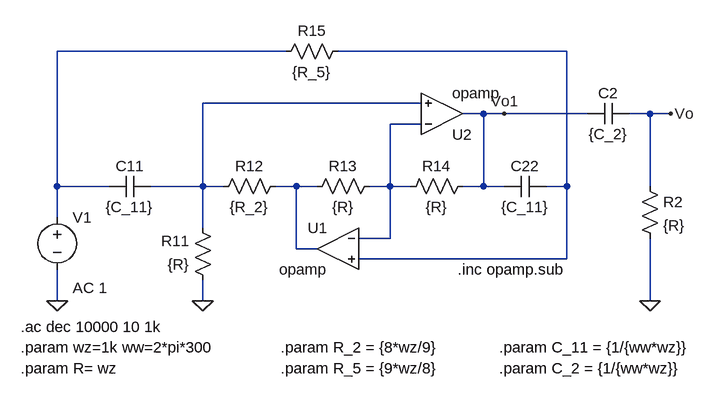
[diagram p0: schematic Circuito_param.asc]
Circuito_param.asc, the LTspice schematic file:
Version 4
SHEET 1 1584 1240
WIRE 240 -96 -112 -96
WIRE 672 -96 320 -96
WIRE 448 -16 112 -16
WIRE 544 0 512 0
WIRE 576 0 544 0
WIRE 704 0 576 0
WIRE 800 0 768 0
WIRE 832 0 800 0
WIRE 448 16 400 16
WIRE -112 112 -112 -96
WIRE -32 112 -112 112
WIRE 112 112 112 -16
WIRE 112 112 32 112
WIRE 144 112 112 112
WIRE 256 112 224 112
WIRE 288 112 256 112
WIRE 400 112 400 16
WIRE 400 112 368 112
WIRE 432 112 400 112
WIRE 544 112 544 0
WIRE 544 112 512 112
WIRE 576 112 544 112
WIRE 672 112 672 -96
WIRE 672 112 640 112
WIRE 800 112 800 0
WIRE -112 160 -112 112
WIRE 112 176 112 112
WIRE 400 192 400 112
WIRE 400 192 352 192
WIRE 256 208 256 112
WIRE 288 208 256 208
WIRE 672 224 672 112
WIRE 672 224 352 224
WIRE -112 288 -112 240
WIRE 112 288 112 256
WIRE 800 288 800 192
FLAG 112 288 0
FLAG 576 0 Vo1
FLAG -112 288 0
FLAG 800 288 0
FLAG 832 0 Vo
SYMBOL cap 32 96 R90
WINDOW 0 0 32 VBottom 2
WINDOW 3 32 32 VTop 2
SYMATTR InstName C11
SYMATTR Value {C_11}
SYMBOL res 240 96 R90
WINDOW 0 0 56 VBottom 2
WINDOW 3 32 56 VTop 2
SYMATTR InstName R12
SYMATTR Value {R_2}
SYMBOL OpAmps\\opamp 320 144 M0
SYMATTR InstName U1
SYMBOL cap 640 96 R90
WINDOW 0 0 32 VBottom 2
WINDOW 3 32 32 VTop 2
SYMATTR InstName C22
SYMATTR Value {C_11}
SYMBOL res 384 96 R90
WINDOW 0 0 56 VBottom 2
WINDOW 3 32 56 VTop 2
SYMATTR InstName R13
SYMATTR Value {R}
SYMBOL res 528 96 R90
WINDOW 0 0 56 VBottom 2
WINDOW 3 32 56 VTop 2
SYMATTR InstName R14
SYMATTR Value {R}
SYMBOL res 336 -112 R90
WINDOW 0 0 56 VBottom 2
WINDOW 3 32 56 VTop 2
SYMATTR InstName R15
SYMATTR Value {R_5}
SYMBOL OpAmps\\opamp 480 64 M180
SYMATTR InstName U2
SYMBOL voltage -112 144 R0
WINDOW 123 24 124 Left 2
WINDOW 39 0 0 Left 0
SYMATTR Value2 AC 1
SYMATTR InstName V1
SYMATTR Value ""
SYMBOL res 128 272 R180
WINDOW 0 36 76 Left 2
WINDOW 3 36 40 Left 2
SYMATTR InstName R11
SYMATTR Value {R}
SYMBOL cap 768 -16 R90
WINDOW 0 0 32 VBottom 2
WINDOW 3 32 32 VTop 2
SYMATTR InstName C2
SYMATTR Value {C_2}
SYMBOL res 784 96 R0
SYMATTR InstName R2
SYMATTR Value {R}
TEXT -168 392 Left 2 !.param R= wz
TEXT 568 360 Left 2 !.param C_11 = {1/{ww*wz}}
TEXT 568 392 Left 2 !.param C_2 = {1/{ww*wz}}
TEXT 232 392 Left 2 !.param R_5 = {9*wz/8}
TEXT 504 240 Left 2 !.inc opamp.sub
TEXT -168 328 Left 2 !.ac dec 10000 10 1k
TEXT -168 360 Left 2 !.param wz=1k ww=2*pi*300
TEXT 232 360 Left 2 !.param R_2 = {8*wz/9}

The netlist it stands for:
* Circuito_param.asc
C11 N003 N001 {C_11}
R12 N005 N003 {R_2}
XU1 N004 N002 N005 opamp Aol=100K GBW=10Meg  ; pins invin noninvin out
C22 N002 Vo1 {C_11}
R13 N004 N005 {R}
R14 Vo1 N004 {R}
R15 N002 N001 {R_5}
XU2 N004 N003 Vo1 opamp Aol=100K GBW=10Meg  ; pins invin noninvin out
V1 N001 0 AC 1
R11 0 N003 {R}
C2 Vo Vo1 {C_2}
R2 Vo 0 {R}
.param R= wz
.param C_11 = {1/{ww*wz}}
.param C_2 = {1/{ww*wz}}
.param R_5 = {9*wz/8}
.inc opamp.sub
.ac dec 10000 10 1k
.param wz=1k ww=2*pi*300
.param R_2 = {8*wz/9}
.backanno
.end